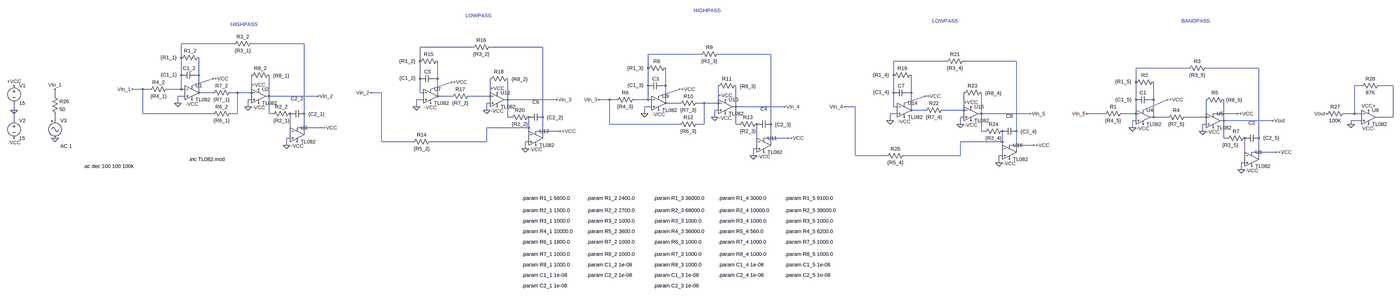
[diagram p0: schematic simulation_generated_20191114-182527.asc, whole sheet]
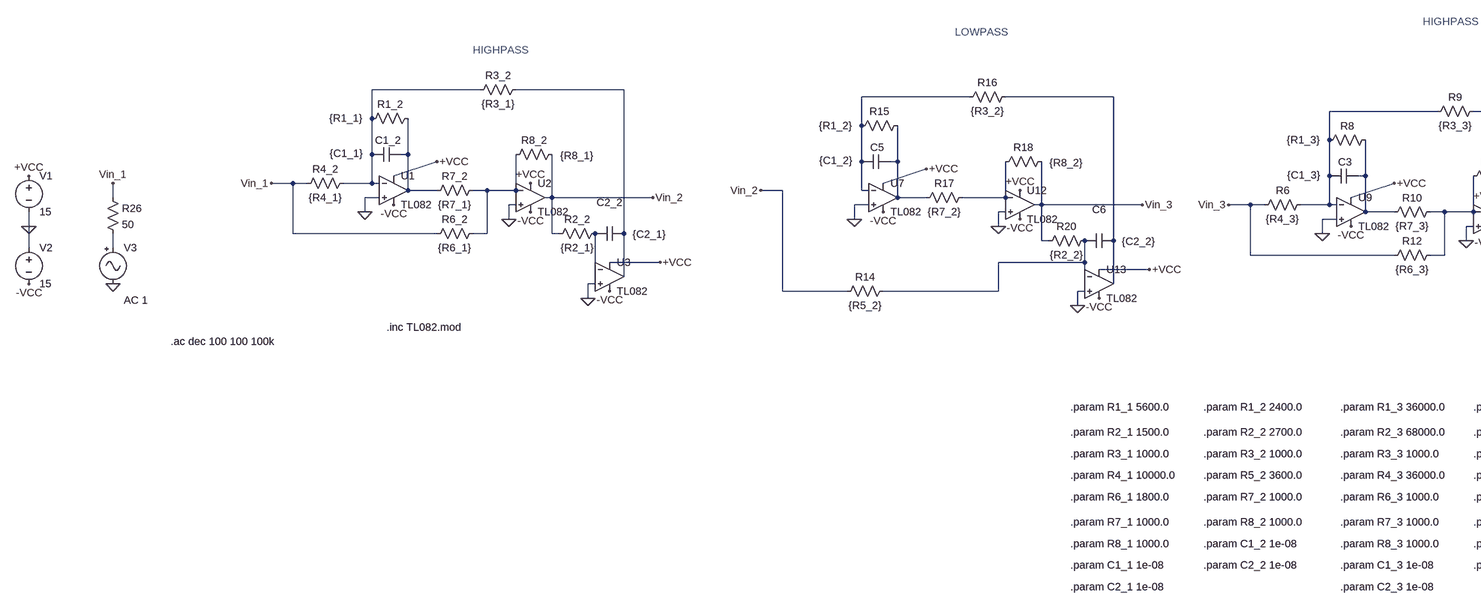
[diagram p1: schematic simulation_generated_20191114-182527.asc, part, row 1 of 1, column 1 of 2]
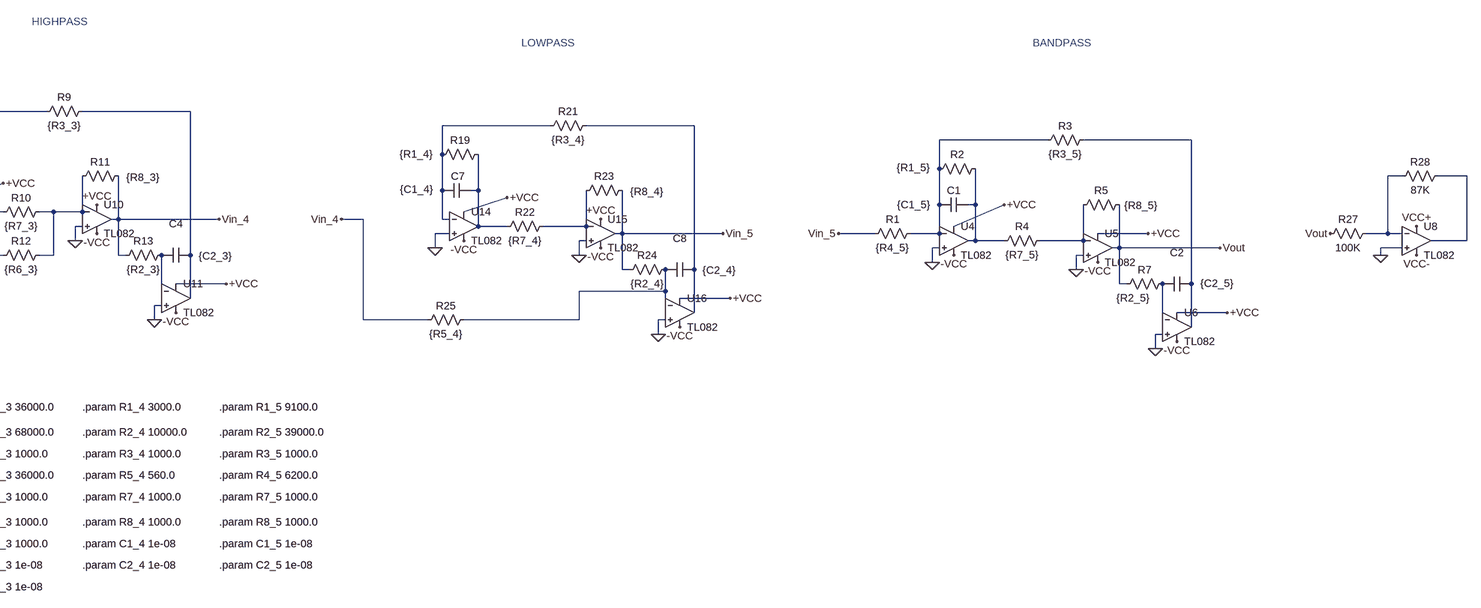
[diagram p2: schematic simulation_generated_20191114-182527.asc, part, row 1 of 1, column 2 of 2]
simulation_generated_20191114-182527.asc, the LTspice schematic file:
Version 4
SHEET 1 4724 1816
WIRE -624 0 -864 0
WIRE -304 0 -544 0
WIRE 464 16 224 16
WIRE 784 16 544 16
WIRE 1504 48 1264 48
WIRE 1824 48 1584 48
WIRE -864 64 -864 0
WIRE 224 80 224 16
WIRE 2624 80 2384 80
WIRE 2944 80 2704 80
WIRE 1264 112 1264 48
WIRE 3744 112 3504 112
WIRE 4064 112 3824 112
WIRE -864 144 -864 64
WIRE -784 144 -784 64
WIRE -784 144 -800 144
WIRE 2384 144 2384 80
WIRE 224 160 224 80
WIRE 304 160 304 80
WIRE 304 160 288 160
WIRE 3504 176 3504 112
WIRE -816 192 -720 160
WIRE 1264 192 1264 112
WIRE 1344 192 1344 112
WIRE 1344 192 1328 192
WIRE 4576 192 4544 192
WIRE 4720 192 4656 192
WIRE -1040 208 -1088 208
WIRE -1008 208 -1040 208
WIRE -864 208 -864 144
WIRE -864 208 -928 208
WIRE -848 208 -864 208
WIRE 272 208 368 176
WIRE -784 224 -784 144
WIRE -720 224 -784 224
WIRE -608 224 -640 224
WIRE -544 224 -544 144
WIRE -544 224 -608 224
WIRE 48 224 0 224
WIRE 224 224 224 160
WIRE 240 224 224 224
WIRE 2384 224 2384 144
WIRE 2464 224 2464 144
WIRE 2464 224 2448 224
WIRE -1440 240 -1440 208
WIRE -848 240 -880 240
WIRE -464 240 -464 144
WIRE -464 240 -480 240
WIRE -240 240 -464 240
WIRE 304 240 304 160
WIRE 368 240 304 240
WIRE 544 240 544 160
WIRE 544 240 448 240
WIRE 1312 240 1408 208
WIRE -544 256 -560 256
WIRE 240 256 208 256
WIRE 624 256 624 160
WIRE 624 256 608 256
WIRE 848 256 624 256
WIRE 1088 256 1040 256
WIRE 1120 256 1088 256
WIRE 1264 256 1264 192
WIRE 1264 256 1200 256
WIRE 1280 256 1264 256
WIRE 3504 256 3504 176
WIRE 3584 256 3584 176
WIRE 3584 256 3568 256
WIRE -880 272 -880 240
WIRE 544 272 528 272
WIRE 1344 272 1344 192
WIRE 1408 272 1344 272
WIRE 1520 272 1488 272
WIRE 1584 272 1584 192
WIRE 1584 272 1520 272
WIRE 2432 272 2528 240
WIRE -560 288 -560 256
WIRE 208 288 208 256
WIRE 1280 288 1248 288
WIRE 1664 288 1664 192
WIRE 1664 288 1648 288
WIRE 1888 288 1664 288
WIRE 2208 288 2160 288
WIRE 2384 288 2384 224
WIRE 2400 288 2384 288
WIRE -1792 304 -1792 272
WIRE 528 304 528 272
WIRE 1584 304 1568 304
WIRE 2464 304 2464 224
WIRE 2528 304 2464 304
WIRE 2704 304 2704 224
WIRE 2704 304 2608 304
WIRE 3536 304 3648 256
WIRE -1040 320 -1040 208
WIRE -720 320 -1040 320
WIRE -608 320 -608 224
WIRE -608 320 -640 320
WIRE -464 320 -464 240
WIRE -448 320 -464 320
WIRE -304 320 -304 0
WIRE 1248 320 1248 288
WIRE 2400 320 2368 320
WIRE 2784 320 2784 224
WIRE 2784 320 2768 320
WIRE 3008 320 2784 320
WIRE 3360 320 3280 320
WIRE 3504 320 3504 256
WIRE 3504 320 3440 320
WIRE 3968 320 3856 320
WIRE 4544 320 4544 192
WIRE 4544 320 4496 320
WIRE 4576 320 4544 320
WIRE 624 336 624 256
WIRE 640 336 624 336
WIRE 784 336 784 16
WIRE 1568 336 1568 304
WIRE 2704 336 2688 336
WIRE 3584 336 3584 256
WIRE 3584 336 3568 336
WIRE 3648 336 3584 336
WIRE 3824 336 3824 256
WIRE 3824 336 3728 336
WIRE 4720 336 4720 192
WIRE 4720 336 4640 336
WIRE -1792 352 -1792 304
WIRE -1440 352 -1440 320
WIRE 2368 352 2368 320
WIRE 3504 352 3488 352
WIRE 3904 352 3904 256
WIRE 3904 352 3888 352
WIRE 4128 352 3904 352
WIRE 4576 352 4528 352
WIRE 1088 368 1088 256
WIRE 1408 368 1088 368
WIRE 1520 368 1520 272
WIRE 1520 368 1488 368
WIRE 1664 368 1664 288
WIRE 1680 368 1664 368
WIRE 1824 368 1824 48
WIRE 2688 368 2688 336
WIRE 3824 368 3808 368
WIRE 4528 368 4528 352
WIRE -224 384 -336 384
WIRE 720 384 720 336
WIRE 720 384 528 384
WIRE 3488 384 3488 352
WIRE -368 400 -368 320
WIRE 864 400 752 400
WIRE 2784 400 2784 320
WIRE 2800 400 2784 400
WIRE 2944 400 2944 80
WIRE 3808 400 3808 368
WIRE -304 416 -304 320
WIRE 720 416 720 384
WIRE -368 432 -384 432
WIRE 784 432 784 336
WIRE 1904 432 1792 432
WIRE 3904 432 3904 352
WIRE 3920 432 3904 432
WIRE 4064 432 4064 112
WIRE 48 448 48 224
WIRE 192 448 48 448
WIRE 528 448 528 384
WIRE 528 448 272 448
WIRE 720 448 704 448
WIRE 1760 448 1760 368
WIRE 2880 448 2880 400
WIRE 2880 448 2688 448
WIRE -384 464 -384 432
WIRE 1824 464 1824 368
WIRE 3024 464 2912 464
WIRE 704 480 704 448
WIRE 1760 480 1744 480
WIRE 2880 480 2880 448
WIRE 2944 496 2944 400
WIRE 4144 496 4032 496
WIRE 1744 512 1744 480
WIRE 2208 512 2208 288
WIRE 2352 512 2208 512
WIRE 2688 512 2688 448
WIRE 2688 512 2432 512
WIRE 2880 512 2864 512
WIRE 4000 512 4000 432
WIRE 4064 528 4064 432
WIRE 2864 544 2864 512
WIRE 4000 544 3984 544
WIRE 3984 576 3984 544
FLAG -880 272 0
FLAG -560 288 0
FLAG -384 464 0
FLAG -1088 208 Vin_1
FLAG -240 240 Vin_2
FLAG 3488 384 0
FLAG 3808 400 0
FLAG 3984 576 0
FLAG 3280 320 Vin_5
FLAG 4128 352 Vout
FLAG -720 160 +VCC
FLAG -816 256 -VCC
FLAG -512 208 +VCC
FLAG -512 272 -VCC
FLAG -224 384 +VCC
FLAG -336 448 -VCC
FLAG 3648 256 +VCC
FLAG 3536 368 -VCC
FLAG 3968 320 +VCC
FLAG 3856 384 -VCC
FLAG 4144 496 +VCC
FLAG 4032 560 -VCC
FLAG 1248 320 0
FLAG 1568 336 0
FLAG 1744 512 0
FLAG 1040 256 Vin_3
FLAG 1888 288 Vin_4
FLAG 1408 208 +VCC
FLAG 1312 304 -VCC
FLAG 1616 256 +VCC
FLAG 1616 320 -VCC
FLAG 1904 432 +VCC
FLAG 1792 496 -VCC
FLAG 208 288 0
FLAG 528 304 0
FLAG 704 480 0
FLAG 0 224 Vin_2
FLAG 848 256 Vin_3
FLAG 368 176 +VCC
FLAG 272 272 -VCC
FLAG 576 224 +VCC
FLAG 576 288 -VCC
FLAG 864 400 +VCC
FLAG 752 464 -VCC
FLAG -1792 304 0
FLAG -1792 192 +VCC
FLAG -1792 432 -VCC
FLAG -1440 432 0
FLAG -1440 208 Vin_1
FLAG 2368 352 0
FLAG 2688 368 0
FLAG 2864 544 0
FLAG 2160 288 Vin_4
FLAG 3008 320 Vin_5
FLAG 2528 240 +VCC
FLAG 2432 336 -VCC
FLAG 2736 288 +VCC
FLAG 2736 352 -VCC
FLAG 3024 464 +VCC
FLAG 2912 528 -VCC
FLAG 4528 368 0
FLAG 4416 320 Vout
FLAG 4608 304 VCC+
FLAG 4608 368 VCC-
SYMBOL res -912 192 R90
WINDOW 0 0 56 VBottom 2
WINDOW 3 32 56 VTop 2
SYMATTR InstName R4_2
SYMATTR Value {R4_1}
SYMBOL res -768 48 R90
WINDOW 0 0 56 VBottom 2
WINDOW 3 0 154 VTop 2
SYMATTR InstName R1_2
SYMATTR Value {R1_1}
SYMBOL cap -800 128 R90
WINDOW 0 0 29 VBottom 2
WINDOW 3 -2 121 VTop 2
SYMATTR InstName C1_2
SYMATTR Value {C1_1}
SYMBOL res -528 -16 R90
WINDOW 0 0 56 VBottom 2
WINDOW 3 32 56 VTop 2
SYMATTR InstName R3_2
SYMATTR Value {R3_1}
SYMBOL res -624 208 R90
WINDOW 0 0 56 VBottom 2
WINDOW 3 32 56 VTop 2
SYMATTR InstName R7_2
SYMATTR Value {R7_1}
SYMBOL res -448 128 R90
WINDOW 0 0 56 VBottom 2
WINDOW 3 3 -39 VTop 2
SYMATTR InstName R8_2
SYMATTR Value {R8_1}
SYMBOL res -624 304 R90
WINDOW 0 0 56 VBottom 2
WINDOW 3 32 56 VTop 2
SYMATTR InstName R6_2
SYMATTR Value {R6_1}
SYMBOL cap -304 304 R90
WINDOW 0 -38 32 VBottom 2
WINDOW 3 2 -56 VTop 2
SYMATTR InstName C2_2
SYMATTR Value {C2_1}
SYMBOL res -352 304 R90
WINDOW 0 0 56 VBottom 2
WINDOW 3 32 56 VTop 2
SYMATTR InstName R2_2
SYMATTR Value {R2_1}
SYMBOL res 3456 304 R90
WINDOW 0 0 56 VBottom 2
WINDOW 3 32 56 VTop 2
SYMATTR InstName R1
SYMATTR Value {R4_5}
SYMBOL res 3600 160 R90
WINDOW 0 0 56 VBottom 2
WINDOW 3 -2 154 VTop 2
SYMATTR InstName R2
SYMATTR Value {R1_5}
SYMBOL cap 3568 240 R90
WINDOW 0 0 32 VBottom 2
WINDOW 3 0 121 VTop 2
SYMATTR InstName C1
SYMATTR Value {C1_5}
SYMBOL res 3840 96 R90
WINDOW 0 0 56 VBottom 2
WINDOW 3 32 56 VTop 2
SYMATTR InstName R3
SYMATTR Value {R3_5}
SYMBOL res 3744 320 R90
WINDOW 0 0 56 VBottom 2
WINDOW 3 32 56 VTop 2
SYMATTR InstName R4
SYMATTR Value {R7_5}
SYMBOL res 3920 240 R90
WINDOW 0 0 56 VBottom 2
WINDOW 3 2 -32 VTop 2
SYMATTR InstName R5
SYMATTR Value {R8_5}
SYMBOL cap 4064 416 R90
WINDOW 0 -38 32 VBottom 2
WINDOW 3 -1 -57 VTop 2
SYMATTR InstName C2
SYMATTR Value {C2_5}
SYMBOL res 4016 416 R90
WINDOW 0 0 56 VBottom 2
WINDOW 3 32 81 VTop 2
SYMATTR InstName R7
SYMATTR Value {R2_5}
SYMBOL Opamps\\opamp2 -816 160 R0
SYMATTR InstName U1
SYMATTR Value TL082
SYMBOL Opamps\\opamp2 -512 176 R0
SYMATTR InstName U2
SYMATTR Value TL082
SYMBOL Opamps\\opamp2 -336 352 R0
SYMATTR InstName U3
SYMATTR Value TL082
SYMBOL Opamps\\opamp2 3536 272 R0
SYMATTR InstName U4
SYMATTR Value TL082
SYMBOL Opamps\\opamp2 3856 288 R0
SYMATTR InstName U5
SYMATTR Value TL082
SYMBOL Opamps\\opamp2 4032 464 R0
SYMATTR InstName U6
SYMATTR Value TL082
SYMBOL res 1216 240 R90
WINDOW 0 0 56 VBottom 2
WINDOW 3 32 56 VTop 2
SYMATTR InstName R6
SYMATTR Value {R4_3}
SYMBOL res 1360 96 R90
WINDOW 0 0 56 VBottom 2
WINDOW 3 0 154 VTop 2
SYMATTR InstName R8
SYMATTR Value {R1_3}
SYMBOL cap 1328 176 R90
WINDOW 0 0 29 VBottom 2
WINDOW 3 -2 121 VTop 2
SYMATTR InstName C3
SYMATTR Value {C1_3}
SYMBOL res 1600 32 R90
WINDOW 0 0 56 VBottom 2
WINDOW 3 32 56 VTop 2
SYMATTR InstName R9
SYMATTR Value {R3_3}
SYMBOL res 1504 256 R90
WINDOW 0 0 56 VBottom 2
WINDOW 3 32 56 VTop 2
SYMATTR InstName R10
SYMATTR Value {R7_3}
SYMBOL res 1680 176 R90
WINDOW 0 0 56 VBottom 2
WINDOW 3 3 -39 VTop 2
SYMATTR InstName R11
SYMATTR Value {R8_3}
SYMBOL res 1504 352 R90
WINDOW 0 0 56 VBottom 2
WINDOW 3 32 56 VTop 2
SYMATTR InstName R12
SYMATTR Value {R6_3}
SYMBOL cap 1824 352 R90
WINDOW 0 -38 32 VBottom 2
WINDOW 3 2 -56 VTop 2
SYMATTR InstName C4
SYMATTR Value {C2_3}
SYMBOL res 1776 352 R90
WINDOW 0 0 56 VBottom 2
WINDOW 3 32 56 VTop 2
SYMATTR InstName R13
SYMATTR Value {R2_3}
SYMBOL Opamps\\opamp2 1312 208 R0
SYMATTR InstName U9
SYMATTR Value TL082
SYMBOL Opamps\\opamp2 1616 224 R0
SYMATTR InstName U10
SYMATTR Value TL082
SYMBOL Opamps\\opamp2 1792 400 R0
SYMATTR InstName U11
SYMATTR Value TL082
SYMBOL res 320 64 R90
WINDOW 0 0 56 VBottom 2
WINDOW 3 0 154 VTop 2
SYMATTR InstName R15
SYMATTR Value {R1_2}
SYMBOL cap 288 144 R90
WINDOW 0 0 29 VBottom 2
WINDOW 3 -2 121 VTop 2
SYMATTR InstName C5
SYMATTR Value {C1_2}
SYMBOL res 560 0 R90
WINDOW 0 0 56 VBottom 2
WINDOW 3 32 56 VTop 2
SYMATTR InstName R16
SYMATTR Value {R3_2}
SYMBOL res 464 224 R90
WINDOW 0 0 56 VBottom 2
WINDOW 3 32 56 VTop 2
SYMATTR InstName R17
SYMATTR Value {R7_2}
SYMBOL res 640 144 R90
WINDOW 0 0 56 VBottom 2
WINDOW 3 3 -39 VTop 2
SYMATTR InstName R18
SYMATTR Value {R8_2}
SYMBOL cap 784 320 R90
WINDOW 0 -38 32 VBottom 2
WINDOW 3 2 -56 VTop 2
SYMATTR InstName C6
SYMATTR Value {C2_2}
SYMBOL res 736 320 R90
WINDOW 0 0 56 VBottom 2
WINDOW 3 32 56 VTop 2
SYMATTR InstName R20
SYMATTR Value {R2_2}
SYMBOL Opamps\\opamp2 272 176 R0
SYMATTR InstName U7
SYMATTR Value TL082
SYMBOL Opamps\\opamp2 576 192 R0
SYMATTR InstName U12
SYMATTR Value TL082
SYMBOL Opamps\\opamp2 752 368 R0
SYMATTR InstName U13
SYMATTR Value TL082
SYMBOL res 288 432 R90
WINDOW 0 0 56 VBottom 2
WINDOW 3 32 56 VTop 2
SYMATTR InstName R14
SYMATTR Value {R5_2}
SYMBOL voltage -1792 176 R0
WINDOW 123 0 0 Left 2
WINDOW 39 0 0 Left 2
SYMATTR InstName V1
SYMATTR Value 15
SYMBOL voltage -1792 336 R0
WINDOW 123 0 0 Left 2
WINDOW 39 0 0 Left 2
SYMATTR InstName V2
SYMATTR Value 15
SYMBOL Misc\\signal -1440 336 R0
WINDOW 123 24 132 Left 2
WINDOW 39 0 0 Left 2
SYMATTR Value2 AC 1
SYMATTR InstName V3
SYMATTR Value ""
SYMBOL res 2480 128 R90
WINDOW 0 0 56 VBottom 2
WINDOW 3 0 154 VTop 2
SYMATTR InstName R19
SYMATTR Value {R1_4}
SYMBOL cap 2448 208 R90
WINDOW 0 0 29 VBottom 2
WINDOW 3 -2 121 VTop 2
SYMATTR InstName C7
SYMATTR Value {C1_4}
SYMBOL res 2720 64 R90
WINDOW 0 0 56 VBottom 2
WINDOW 3 32 56 VTop 2
SYMATTR InstName R21
SYMATTR Value {R3_4}
SYMBOL res 2624 288 R90
WINDOW 0 0 56 VBottom 2
WINDOW 3 32 56 VTop 2
SYMATTR InstName R22
SYMATTR Value {R7_4}
SYMBOL res 2800 208 R90
WINDOW 0 0 56 VBottom 2
WINDOW 3 3 -39 VTop 2
SYMATTR InstName R23
SYMATTR Value {R8_4}
SYMBOL cap 2944 384 R90
WINDOW 0 -38 32 VBottom 2
WINDOW 3 2 -56 VTop 2
SYMATTR InstName C8
SYMATTR Value {C2_4}
SYMBOL res 2896 384 R90
WINDOW 0 0 56 VBottom 2
WINDOW 3 32 56 VTop 2
SYMATTR InstName R24
SYMATTR Value {R2_4}
SYMBOL Opamps\\opamp2 2432 240 R0
SYMATTR InstName U14
SYMATTR Value TL082
SYMBOL Opamps\\opamp2 2736 256 R0
SYMATTR InstName U15
SYMATTR Value TL082
SYMBOL Opamps\\opamp2 2912 432 R0
SYMATTR InstName U16
SYMATTR Value TL082
SYMBOL res 2448 496 R90
WINDOW 0 0 56 VBottom 2
WINDOW 3 32 56 VTop 2
SYMATTR InstName R25
SYMATTR Value {R5_4}
SYMBOL res -1456 224 R0
SYMATTR InstName R26
SYMATTR Value 50
SYMBOL Opamps\\opamp2 4608 272 R0
SYMATTR InstName U8
SYMATTR Value TL082
SYMBOL res 4512 304 R90
WINDOW 0 0 56 VBottom 2
WINDOW 3 32 56 VTop 2
SYMATTR InstName R27
SYMATTR Value 100K
SYMBOL res 4672 176 R90
WINDOW 0 0 56 VBottom 2
WINDOW 3 32 56 VTop 2
SYMATTR InstName R28
SYMATTR Value 87K
TEXT -832 528 Left 2 !.inc TL082.mod
TEXT -1312 560 Left 2 !.ac dec 100 100 100k
TEXT 432 -128 Left 2 ;LOWPASS
TEXT -640 -88 Left 2 ;HIGHPASS
TEXT 2560 -104 Left 2 ;LOWPASS
TEXT 1472 -152 Left 2 ;HIGHPASS
TEXT 3712 -104 Left 2 ;BANDPASS
TEXT 688 784 Left 2 !.param R1_1 5600.0
TEXT 688 840 Left 2 !.param R2_1 1500.0
TEXT 688 888 Left 2 !.param R3_1 1000.0
TEXT 688 936 Left 2 !.param R4_1 10000.0
TEXT 688 984 Left 2 !.param R6_1 1800.0
TEXT 688 1040 Left 2 !.param R7_1 1000.0
TEXT 688 1088 Left 2 !.param R8_1 1000.0
TEXT 688 1136 Left 2 !.param C1_1 1e-08
TEXT 688 1184 Left 2 !.param C2_1 1e-08
TEXT 984 784 Left 2 !.param R1_2 2400.0
TEXT 984 840 Left 2 !.param R2_2 2700.0
TEXT 984 888 Left 2 !.param R3_2 1000.0
TEXT 984 936 Left 2 !.param R5_2 3600.0
TEXT 984 984 Left 2 !.param R7_2 1000.0
TEXT 984 1040 Left 2 !.param R8_2 1000.0
TEXT 984 1088 Left 2 !.param C1_2 1e-08
TEXT 984 1136 Left 2 !.param C2_2 1e-08
TEXT 1288 784 Left 2 !.param R1_3 36000.0
TEXT 1288 840 Left 2 !.param R2_3 68000.0
TEXT 1288 888 Left 2 !.param R3_3 1000.0
TEXT 1288 936 Left 2 !.param R4_3 36000.0
TEXT 1288 984 Left 2 !.param R6_3 1000.0
TEXT 1288 1040 Left 2 !.param R7_3 1000.0
TEXT 1288 1088 Left 2 !.param R8_3 1000.0
TEXT 1288 1136 Left 2 !.param C1_3 1e-08
TEXT 1288 1184 Left 2 !.param C2_3 1e-08
TEXT 1584 784 Left 2 !.param R1_4 3000.0
TEXT 1584 840 Left 2 !.param R2_4 10000.0
TEXT 1584 888 Left 2 !.param R3_4 1000.0
TEXT 1584 936 Left 2 !.param R5_4 560.0
TEXT 1584 984 Left 2 !.param R7_4 1000.0
TEXT 1584 1040 Left 2 !.param R8_4 1000.0
TEXT 1584 1088 Left 2 !.param C1_4 1e-08
TEXT 1584 1136 Left 2 !.param C2_4 1e-08
TEXT 1888 784 Left 2 !.param R1_5 9100.0
TEXT 1888 840 Left 2 !.param R2_5 39000.0
TEXT 1888 888 Left 2 !.param R3_5 1000.0
TEXT 1888 936 Left 2 !.param R4_5 6200.0
TEXT 1888 984 Left 2 !.param R7_5 1000.0
TEXT 1888 1040 Left 2 !.param R8_5 1000.0
TEXT 1888 1088 Left 2 !.param C1_5 1e-08
TEXT 1888 1136 Left 2 !.param C2_5 1e-08

The netlist it stands for:
* simulation_generated_20191114-182527.asc
R4_2 N001 Vin_1 {R4_1}
R1_2 N011 N001 {R1_1}
C1_2 N011 N001 {C1_1}
R3_2 N002 N001 {R3_1}
R7_2 N016 N011 {R7_1}
R8_2 Vin_2 N016 {R8_1}
R6_2 N016 Vin_1 {R6_1}
C2_2 N002 N025 {C2_1}
R2_2 N025 Vin_2 {R2_1}
R1 N009 Vin_5 {R4_5}
R2 N019 N009 {R1_5}
C1 N019 N009 {C1_5}
R3 N010 N009 {R3_5}
R4 N022 N019 {R7_5}
R5 Vout N022 {R8_5}
C2 N010 N028 {C2_5}
R7 N028 Vout {R2_5}
XU1 0 N001 +VCC -VCC N011 TL082  ; pins In+ In- V+ V- OUT
XU2 0 N016 +VCC -VCC Vin_2 TL082  ; pins In+ In- V+ V- OUT
XU3 0 N025 +VCC -VCC N002 TL082  ; pins In+ In- V+ V- OUT
XU4 0 N009 +VCC -VCC N019 TL082  ; pins In+ In- V+ V- OUT
XU5 0 N022 +VCC -VCC Vout TL082  ; pins In+ In- V+ V- OUT
XU6 0 N028 +VCC -VCC N010 TL082  ; pins In+ In- V+ V- OUT
R6 N005 Vin_3 {R4_3}
R8 N013 N005 {R1_3}
C3 N013 N005 {C1_3}
R9 N006 N005 {R3_3}
R10 N020 N013 {R7_3}
R11 Vin_4 N020 {R8_3}
R12 N020 Vin_3 {R6_3}
C4 N006 N026 {C2_3}
R13 N026 Vin_4 {R2_3}
XU9 0 N005 +VCC -VCC N013 TL082  ; pins In+ In- V+ V- OUT
XU10 0 N020 +VCC -VCC Vin_4 TL082  ; pins In+ In- V+ V- OUT
XU11 0 N026 +VCC -VCC N006 TL082  ; pins In+ In- V+ V- OUT
R15 N012 N003 {R1_2}
C5 N012 N003 {C1_2}
R16 N004 N003 {R3_2}
R17 N018 N012 {R7_2}
R18 Vin_3 N018 {R8_2}
C6 N004 N024 {C2_2}
R20 N024 Vin_3 {R2_2}
XU7 0 N003 +VCC -VCC N012 TL082  ; pins In+ In- V+ V- OUT
XU12 0 N018 +VCC -VCC Vin_3 TL082  ; pins In+ In- V+ V- OUT
XU13 0 N024 +VCC -VCC N004 TL082  ; pins In+ In- V+ V- OUT
R14 N024 Vin_2 {R5_2}
V1 +VCC 0 15
V2 0 -VCC 15
V3 N023 0 AC 1
R19 N017 N007 {R1_4}
C7 N017 N007 {C1_4}
R21 N008 N007 {R3_4}
R22 N021 N017 {R7_4}
R23 Vin_5 N021 {R8_4}
C8 N008 N027 {C2_4}
R24 N027 Vin_5 {R2_4}
XU14 0 N007 +VCC -VCC N017 TL082  ; pins In+ In- V+ V- OUT
XU15 0 N021 +VCC -VCC Vin_5 TL082  ; pins In+ In- V+ V- OUT
XU16 0 N027 +VCC -VCC N008 TL082  ; pins In+ In- V+ V- OUT
R25 N027 Vin_4 {R5_4}
R26 Vin_1 N023 50
XU8 0 N014 VCC+ VCC- N015 TL082  ; pins In+ In- V+ V- OUT
R27 N014 Vout 100K
R28 N015 N014 87K
.inc TL082.mod
.ac dec 100 100 100k
* LOWPASS
* HIGHPASS
* LOWPASS
* HIGHPASS
* BANDPASS
.param R1_1 5600.0
.param R2_1 1500.0
.param R3_1 1000.0
.param R4_1 10000.0
.param R6_1 1800.0
.param R7_1 1000.0
.param R8_1 1000.0
.param C1_1 1e-08
.param C2_1 1e-08
.param R1_2 2400.0
.param R2_2 2700.0
.param R3_2 1000.0
.param R5_2 3600.0
.param R7_2 1000.0
.param R8_2 1000.0
.param C1_2 1e-08
.param C2_2 1e-08
.param R1_3 36000.0
.param R2_3 68000.0
.param R3_3 1000.0
.param R4_3 36000.0
.param R6_3 1000.0
.param R7_3 1000.0
.param R8_3 1000.0
.param C1_3 1e-08
.param C2_3 1e-08
.param R1_4 3000.0
.param R2_4 10000.0
.param R3_4 1000.0
.param R5_4 560.0
.param R7_4 1000.0
.param R8_4 1000.0
.param C1_4 1e-08
.param C2_4 1e-08
.param R1_5 9100.0
.param R2_5 39000.0
.param R3_5 1000.0
.param R4_5 6200.0
.param R7_5 1000.0
.param R8_5 1000.0
.param C1_5 1e-08
.param C2_5 1e-08
.backanno
.end